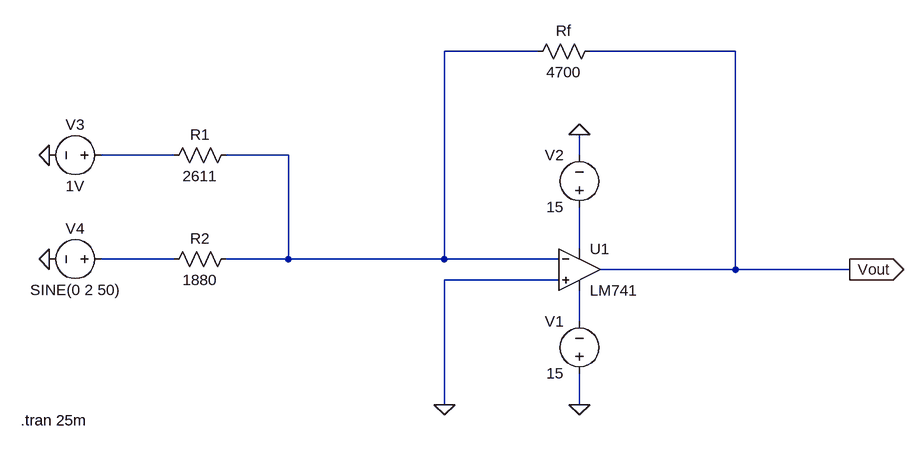
[diagram p0: schematic Lab5_OPAMP_Adder.asc]
Lab5_OPAMP_Adder.asc, the LTspice schematic file:
Version 4
SHEET 1 880 680
WIRE 144 -144 0 -144
WIRE 448 -144 224 -144
WIRE -416 16 -528 16
WIRE -240 16 -336 16
WIRE 208 16 208 -16
WIRE 208 160 208 96
WIRE -416 176 -528 176
WIRE -240 176 -240 16
WIRE -240 176 -336 176
WIRE 0 176 0 -144
WIRE 0 176 -240 176
WIRE 176 176 0 176
WIRE 448 192 448 -144
WIRE 448 192 240 192
WIRE 624 192 448 192
WIRE 176 208 0 208
WIRE 208 272 208 224
WIRE 0 400 0 208
WIRE 208 400 208 352
FLAG 208 400 0
FLAG 208 -16 0
FLAG 0 400 0
FLAG -608 16 0
FLAG -608 176 0
FLAG 624 192 Vout
IOPIN 624 192 Out
SYMBOL OpAmps\\LM741 208 128 R0
SYMATTR InstName U1
SYMBOL voltage 208 368 R180
WINDOW 0 24 96 Left 2
WINDOW 3 24 16 Left 2
WINDOW 123 0 0 Left 0
WINDOW 39 0 0 Left 0
SYMATTR InstName V1
SYMATTR Value 15
SYMBOL voltage 208 112 R180
WINDOW 0 24 96 Left 2
WINDOW 3 24 16 Left 2
WINDOW 123 0 0 Left 0
WINDOW 39 0 0 Left 0
SYMATTR InstName V2
SYMATTR Value 15
SYMBOL res 240 -160 R90
WINDOW 0 0 56 VBottom 2
WINDOW 3 32 56 VTop 2
SYMATTR InstName Rf
SYMATTR Value 4700
SYMBOL res -320 0 R90
WINDOW 0 0 56 VBottom 2
WINDOW 3 32 56 VTop 2
SYMATTR InstName R1
SYMATTR Value 2611
SYMBOL res -320 160 R90
WINDOW 0 0 56 VBottom 2
WINDOW 3 32 56 VTop 2
SYMATTR InstName R2
SYMATTR Value 1880
SYMBOL voltage -512 16 R90
WINDOW 0 -32 56 VBottom 2
WINDOW 3 32 56 VTop 2
WINDOW 123 0 0 Left 0
WINDOW 39 0 0 Left 0
SYMATTR InstName V3
SYMATTR Value 1V
SYMBOL voltage -512 176 R90
WINDOW 0 -32 56 VBottom 2
WINDOW 3 32 56 VTop 2
WINDOW 123 0 0 Left 0
WINDOW 39 0 0 Left 0
SYMATTR InstName V4
SYMATTR Value SINE(0 2 50)
TEXT -652 424 Left 2 !.tran 25m

The netlist it stands for:
* Lab5_OPAMP_Adder.asc
XU1 0 N001 N003 N005 Vout LM741  ; pins In+ In- V+ V- OUT
V1 0 N005 15
V2 N003 0 15
Rf Vout N001 4700
R1 N001 N002 2611
R2 N001 N004 1880
V3 N002 0 1V
V4 N004 0 SINE(0 2 50)
.tran 25m
.lib LM741.lib
.backanno
.end